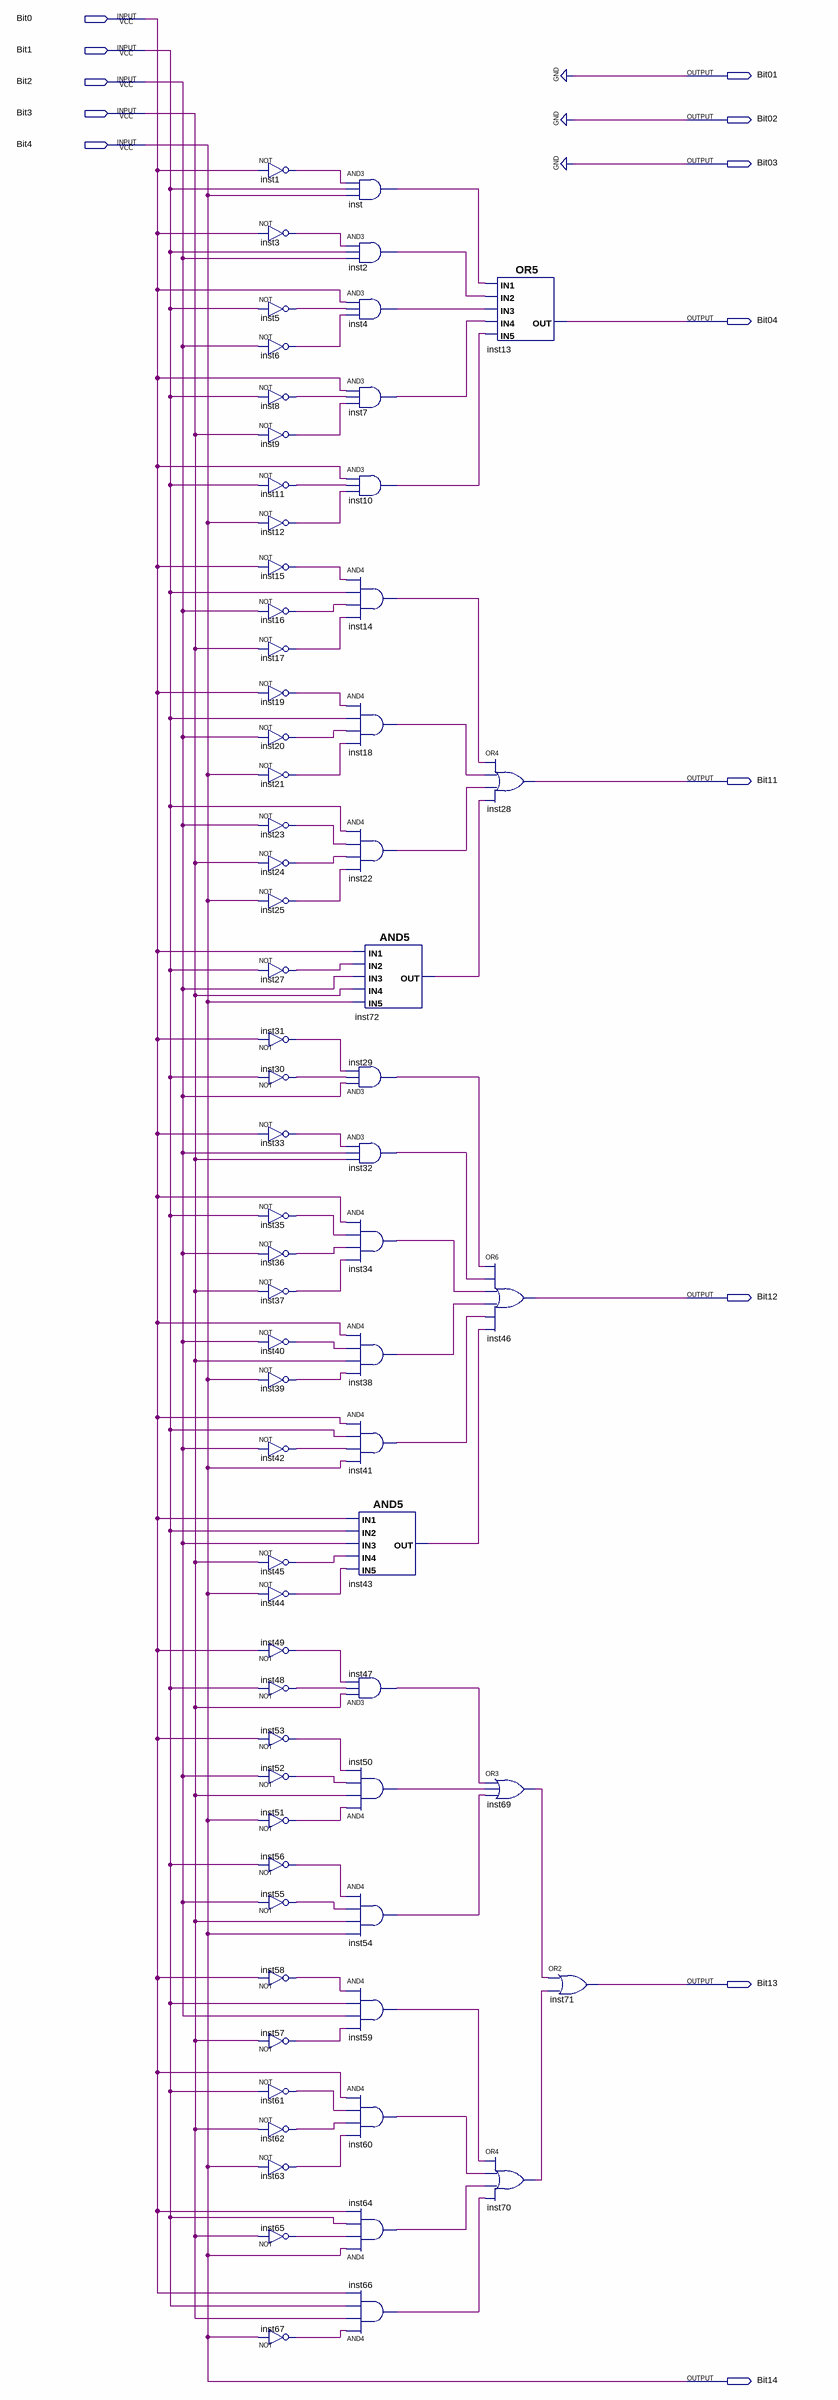
[diagram p0: schematic sheet]
// Quartus schematic codificadorResultado.bdf as structural Verilog: 71 symbols, 13 pins
module codificadorResultado (
  input  Bit0,
  input  Bit1,
  input  Bit2,
  input  Bit3,
  input  Bit4,
  output Bit01,
  output Bit02,
  output Bit03,
  output Bit04,
  output Bit11,
  output Bit12,
  output Bit13,
  output Bit14
);

  wire inst1_out, inst2_out, inst3_out, inst4_out, inst5_out, inst6_out, inst7_out, inst8_out, inst9_out,
       inst10_out, inst11_out, inst12_out, inst14_out, inst15_out, inst16_out, inst17_out, inst18_out,
       inst19_out, inst20_out, inst21_out, inst22_out, inst23_out, inst24_out, inst25_out, inst27_out,
       inst29_out, inst30_out, inst31_out, inst32_out, inst33_out, inst34_out, inst35_out, inst36_out,
       inst37_out, inst38_out, inst39_out, inst40_out, inst41_out, inst42_out, inst43_out, inst44_out,
       inst45_out, inst47_out, inst48_out, inst49_out, inst50_out, inst51_out, inst52_out, inst53_out,
       inst54_out, inst55_out, inst56_out, inst57_out, inst58_out, inst59_out, inst60_out, inst61_out,
       inst62_out, inst63_out, inst64_out, inst65_out, inst66_out, inst67_out, inst69_out, inst70_out,
       inst72_out, inst_out;

  not inst1 (inst1_out, Bit0);
  not inst3 (inst3_out, Bit0);
  not inst5 (inst5_out, Bit1);
  not inst6 (inst6_out, Bit2);
  not inst8 (inst8_out, Bit1);
  not inst9 (inst9_out, Bit3);
  not inst11 (inst11_out, Bit1);
  not inst12 (inst12_out, Bit4);
  not inst15 (inst15_out, Bit0);
  not inst16 (inst16_out, Bit2);
  not inst17 (inst17_out, Bit3);
  not inst19 (inst19_out, Bit0);
  not inst20 (inst20_out, Bit2);
  not inst21 (inst21_out, Bit4);
  not inst23 (inst23_out, Bit2);
  not inst24 (inst24_out, Bit3);
  not inst25 (inst25_out, Bit4);
  not inst27 (inst27_out, Bit1);
  not inst31 (inst31_out, Bit0);
  not inst30 (inst30_out, Bit1);
  not inst33 (inst33_out, Bit0);
  not inst35 (inst35_out, Bit1);
  not inst36 (inst36_out, Bit2);
  not inst37 (inst37_out, Bit3);
  not inst40 (inst40_out, Bit2);
  not inst39 (inst39_out, Bit4);
  not inst42 (inst42_out, Bit2);
  not inst45 (inst45_out, Bit3);
  not inst44 (inst44_out, Bit4);
  not inst49 (inst49_out, Bit0);
  not inst48 (inst48_out, Bit1);
  not inst53 (inst53_out, Bit0);
  not inst52 (inst52_out, Bit2);
  not inst51 (inst51_out, Bit4);
  not inst56 (inst56_out, Bit1);
  not inst55 (inst55_out, Bit2);
  not inst58 (inst58_out, Bit0);
  not inst57 (inst57_out, Bit3);
  not inst61 (inst61_out, Bit1);
  not inst62 (inst62_out, Bit3);
  not inst63 (inst63_out, Bit4);
  not inst65 (inst65_out, Bit3);
  not inst67 (inst67_out, Bit4);
  and inst (inst_out, inst1_out, Bit1, Bit4);
  and inst2 (inst2_out, inst3_out, Bit1, Bit2);
  and inst4 (inst4_out, Bit0, inst5_out, inst6_out);
  and inst7 (inst7_out, Bit0, inst8_out, inst9_out);
  and inst10 (inst10_out, Bit0, inst11_out, inst12_out);
  and inst14 (inst14_out, inst15_out, Bit1, inst16_out, inst17_out);
  and inst18 (inst18_out, inst19_out, Bit1, inst20_out, inst21_out);
  and inst22 (inst22_out, Bit1, inst23_out, inst24_out, inst25_out);
  and inst72 (inst72_out, Bit0, inst27_out, Bit2, Bit3, Bit4);
  and inst29 (inst29_out, Bit2, inst30_out, inst31_out);
  and inst32 (inst32_out, inst33_out, Bit2, Bit3);
  and inst34 (inst34_out, Bit0, inst35_out, inst36_out, inst37_out);
  and inst38 (inst38_out, Bit0, inst40_out, Bit3, inst39_out);
  and inst41 (inst41_out, Bit0, Bit1, inst42_out, Bit4);
  and inst43 (inst43_out, Bit0, Bit1, Bit2, inst45_out, inst44_out);
  and inst47 (inst47_out, Bit3, inst48_out, inst49_out);
  and inst50 (inst50_out, inst51_out, Bit3, inst52_out, inst53_out);
  and inst54 (inst54_out, inst56_out, inst55_out, Bit3, Bit4);
  and inst59 (inst59_out, inst58_out, Bit1, Bit2, inst57_out);
  and inst60 (inst60_out, Bit0, inst61_out, inst62_out, inst63_out);
  and inst64 (inst64_out, Bit4, inst65_out, Bit1, Bit0);
  and inst66 (inst66_out, inst67_out, Bit3, Bit1, Bit0);
  or inst13 (Bit04, inst_out, inst2_out, inst4_out, inst7_out, inst10_out);
  or inst28 (Bit11, inst14_out, inst18_out, inst22_out, inst72_out);
  or inst46 (Bit12, inst29_out, inst32_out, inst34_out, inst38_out, inst41_out, inst43_out);
  or inst69 (inst69_out, inst47_out, inst50_out, inst54_out);
  or inst70 (inst70_out, inst59_out, inst60_out, inst64_out, inst66_out);
  or inst71 (Bit13, inst69_out, inst70_out);

  assign Bit01 = 1'b0;
  assign Bit02 = 1'b0;
  assign Bit03 = 1'b0;
  assign Bit14 = Bit4;
endmodule
